# EAGLE schematic AE_ESP_mnt_board (EAGLE 7.5.0)
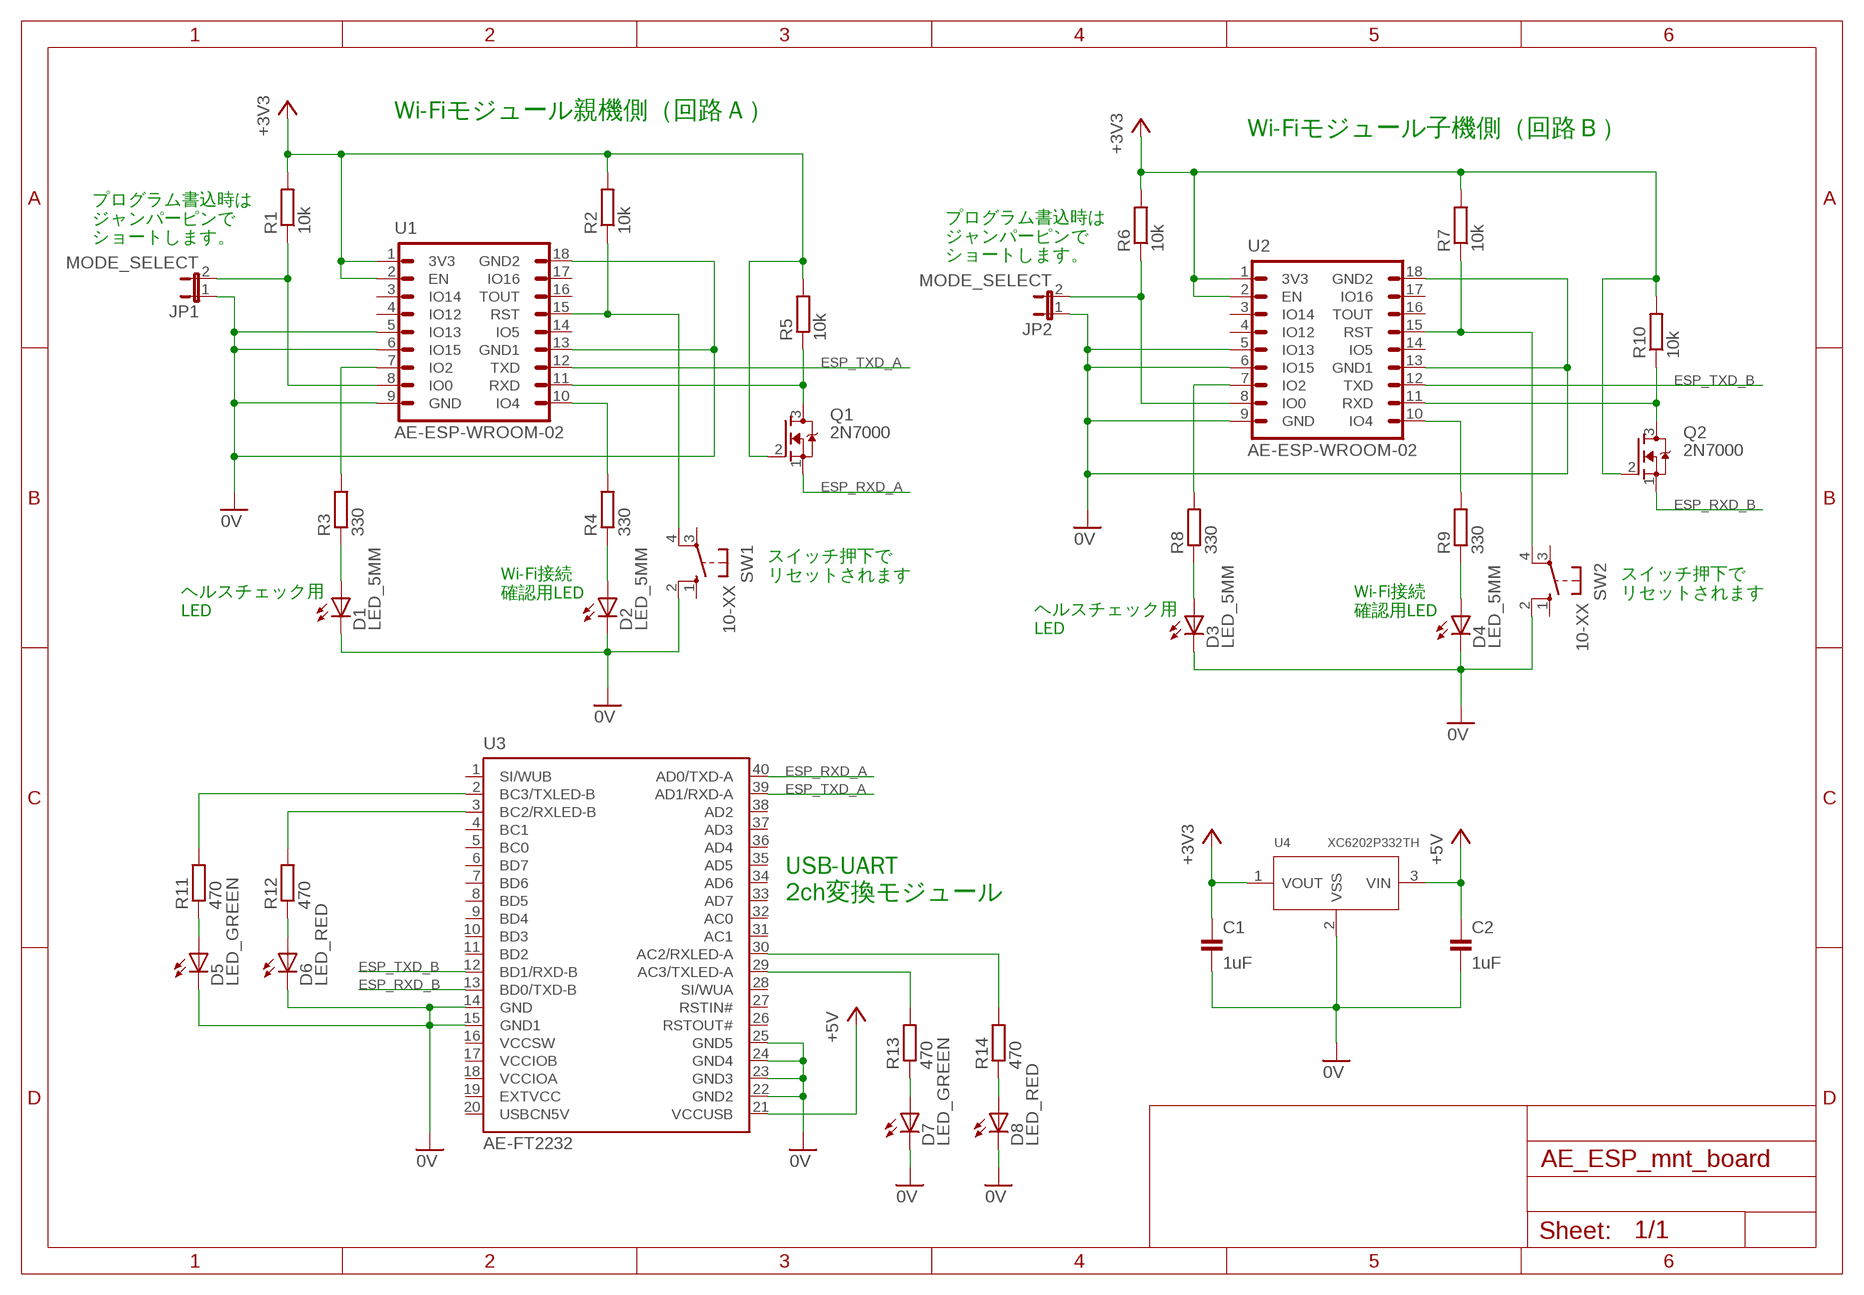
[diagram p0: schematic, sheet 1]

## Parts
C1  1uF  CAP_200MIL  [CAP_200MIL]
C2  1uF  CAP_200MIL  [CAP_200MIL]
D1  LED_5MM  [LED5MM]
D2  LED_5MM  [LED5MM]
D3  LED_5MM  [LED5MM]
D4  LED_5MM  [LED5MM]
D5  LED_GREEN  LED_5MM  [LED5MM]
D6  LED_RED  LED_5MM  [LED5MM]
D7  LED_GREEN  LED_5MM  [LED5MM]
D8  LED_RED  LED_5MM  [LED5MM]
JP1  MODE_SELECT  JP1E  [JP1]
JP2  MODE_SELECT  JP1E  [JP1]
Q1  2N7000  [TO-92NL]
Q2  2N7000  [TO-92NL]
R1  10k  RESISTOR_300MIL  [RESISTOR_0207_300MIL]
R2  10k  RESISTOR_300MIL  [RESISTOR_0207_300MIL]
R3  330  RESISTOR_300MIL  [RESISTOR_0207_300MIL]
R4  330  RESISTOR_300MIL  [RESISTOR_0207_300MIL]
R5  10k  RESISTOR_300MIL  [RESISTOR_0207_300MIL]
R6  10k  RESISTOR_300MIL  [RESISTOR_0207_300MIL]
R7  10k  RESISTOR_300MIL  [RESISTOR_0207_300MIL]
R8  330  RESISTOR_300MIL  [RESISTOR_0207_300MIL]
R9  330  RESISTOR_300MIL  [RESISTOR_0207_300MIL]
R10  10k  RESISTOR_300MIL  [RESISTOR_0207_300MIL]
R11  470  RESISTOR_300MIL  [RESISTOR_0207_300MIL]
R12  470  RESISTOR_300MIL  [RESISTOR_0207_300MIL]
R13  470  RESISTOR_300MIL  [RESISTOR_0207_300MIL]
R14  470  RESISTOR_300MIL  [RESISTOR_0207_300MIL]
SW1  10-XX  [B3F-10XX]
SW2  10-XX  [B3F-10XX]
U1  AE-ESP-WROOM-02  [DIL18_AE-ESP-WROOM-02]
U2  AE-ESP-WROOM-02  [DIL18_AE-ESP-WROOM-02]
U3  AE-FT2232  [DIL40]
U4  XC6202P332TH  [TO92-LINE]

## Nets
0V: C1.2 C2.2 D1.K(C) D2.K(C) D3.K(C) D4.K(C) D5.K(C) D6.K(C) D7.K(C) D8.K(C) JP1.1 JP2.1 SW1.2(S1) SW2.2(S1) U1.5(IO13) U1.6(IO15) U1.9(GND) U1.13(GND1) U1.18(GND2) U2.5(IO13) U2.6(IO15) U2.9(GND) U2.13(GND1) U2.18(GND2) U3.14(GND) U3.15(GND1) U3.22(GND2) U3.23(GND3) U3.24(GND4) U3.25(GND5) U4.2(VSS)
+3V3: C1.1 Q1.2(G) Q2.2(G) R1.2 R2.2 R5.2 R6.2 R7.2 R10.2 U1.1(3V3) U1.2(EN) U2.1(3V3) U2.2(EN) U4.1(VOUT)
+5V: C2.1 U3.21(VCCUSB) U4.3(VIN)
ESP_RXD_A: Q1.1(S) U3.40(AD0/TXD-A)
ESP_RXD_B: Q2.1(S) U3.13(BD0/TXD-B)
ESP_TXD_A: U1.12(TXD) U3.39(AD1/RXD-A)
ESP_TXD_B: U2.12(TXD) U3.12(BD1/RXD-B)
LED_CONNECTING: R4.2 U1.10(IO4)
LED_CONNECTING1: R9.2 U2.10(IO4)
LED_HCHECK: R3.2 U1.7(IO2)
LED_HCHECK1: R8.2 U2.7(IO2)
N$1: Q2.3(D) R10.1 U2.11(RXD)
N$2: JP2.2 R6.1 U2.8(IO0)
N$3: R7.1 SW2.4(P1) U2.15(RST)
N$4: D4.A R9.1
N$5: D3.A R8.1
N$6: R11.2 U3.2(BC3/TXLED-B)
N$7: Q1.3(D) R5.1 U1.11(RXD)
N$8: R12.2 U3.3(BC2/RXLED-B)
N$9: JP1.2 R1.1 U1.8(IO0)
N$10: R2.1 SW1.4(P1) U1.15(RST)
N$11: D2.A R4.1
N$12: D1.A R3.1
N$13: D6.A R12.1
N$14: D5.A R11.1
N$17: R13.2 U3.29(AC3/TXLED-A)
N$18: R14.2 U3.30(AC2/RXLED-A)
N$19: D8.A R14.1
N$20: D7.A R13.1
Unconnected: SW1.1(S) SW1.3(P) SW2.1(S) SW2.3(P) U1.3(IO14) U1.4(IO12) U1.14(IO5) U1.16(TOUT) U1.17(IO16) U2.3(IO14) U2.4(IO12) U2.14(IO5) U2.16(TOUT) U2.17(IO16) U3.1(SI/WUB) U3.4(BC1) U3.5(BC0) U3.6(BD7) U3.7(BD6) U3.8(BD5) U3.9(BD4) U3.10(BD3) U3.11(BD2) U3.16(VCCSW) U3.17(VCCIOB) U3.18(VCCIOA) U3.19(EXTVCC) U3.20(USBCN5V) U3.26(RSTOUT#) U3.27(RSTIN#) U3.28(SI/WUA) U3.31(AC1) U3.32(AC0) U3.33(AD7) U3.34(AD6) U3.35(AD5) U3.36(AD4) U3.37(AD3) U3.38(AD2)

## Notes on the sheet
- Wi-Fiモジュール親機側（回路Ａ）
- Wi-Fiモジュール子機側（回路Ｂ）
- プログラム書込時は
  ジャンパーピンで
  ショートします。
- プログラム書込時は
  ジャンパーピンで
  ショートします。
- スイッチ押下で
  リセットされます
- Wi-Fi接続
  確認用LED
- スイッチ押下で
  リセットされます
- ヘルスチェック用
  LED
- Wi-Fi接続
  確認用LED
- ヘルスチェック用
  LED
- USB-UART
  2ch変換モジュール

## Library data of the parts
C1 C2 = Parts:CAP: コンデンサー
D1-D8 = Parts:LED: 発光ダイオード
JP1 JP2 = Parts:JP1E: JUMPER
Q1 Q2 = Parts:2N7000: Ｎチャネル エンハンスメントタイプ ＭＯＳＦＥＴ ■ VDSS ６０Ｖ ■ VGSS ±２０Ｖ ■ RDS(ON) 標準３．２Ω 最大７．５Ω（＠VGS=5.0V） ■ ID １１５ｍＡ ■ PD ３００ｍＷ ■ Ciss 標準２２ｐＦ 最大５０ｐＦ ■ Coss 標準１１ｐＦ 最大２５ｐＦ ■ Crss 標準２ｐＦ 最大５ｐＦ ■ tD(ON) 標準７ｎｓ 最大２０ｎｓ ■ tD(OFF) 標準１１ｎｓ 最大２０ｎｓ ■ 形状：ＳＯＴ－２３
R1-R14 = Parts:RESISTOR: 抵抗器
SW1 SW2 = Parts:10-XX: TACT SWITCH
U1 U2 = PartsForProto:AE-ESP-WROOM-02: Ｗｉ－Ｆｉモジュール ＤＩＰ化キット ＥＳＰ－ＷＲＯＯＭ－０２は ＥＳＰ８２６６ＥＸ（ＳｏＣ、３２ｂｉｔ ＭＣＵ）を搭載した ＷｉＦｉモジュールです。
U3 = PartsForProto:AE-FT2232: ＦＴ２２３２Ｄ ＵＳＢ－シリアル２ｃｈ変換モジュール シリアル／パラレル混在動作も可能。 仮想ＣＯＭポートモードにより、Ｗｉｎｄｏｗｓ標準のＣＯＭポートが２ポート増設されます。 ■ＦＴ２２３２はＦＴ２３２とＦＴ２４５の機能２個が１チップに内蔵されています。 ■通信速度３００ｂｐｓ～１０００ｋｂｐｓ（ＲＳ２３２） ■３８４バイト受信バッファ、１２８バイト送信バッファ内蔵 ■ビットバングモードを各チャンネルで使用可能。 ■寸法：２０ｍｍｘ６０．３ｍｍｘ１８．７ｍｍ
U4 = Parts:XC6202*: 低損失ＣＭＯＳ三端子レギュレーター ・定格出力：５Ｖ ・最大出力電流：１５０ｍＡ以上 ・入力最大電圧：２０Ｖ ・入出力電圧差： ０．２Ｖ（３０ｍＡ時） ０．６７Ｖ（１００ｍＡ時） ・低消費電流：１０μＡ